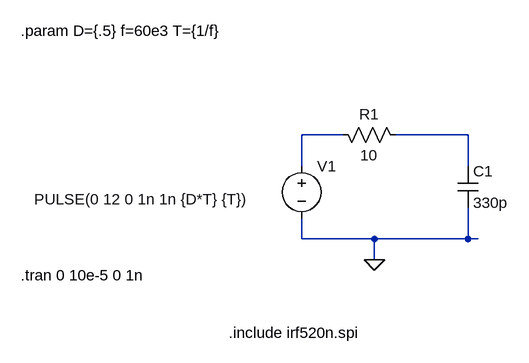
[diagram p0: schematic Draft1.asc]
Draft1.asc, the LTspice schematic file:
Version 4
SHEET 1 880 680
WIRE 144 112 80 112
WIRE 336 112 224 112
WIRE 80 160 80 112
WIRE 336 160 336 112
WIRE 80 272 80 240
WIRE 192 272 80 272
WIRE 336 272 336 224
WIRE 336 272 192 272
WIRE 352 272 336 272
WIRE 192 304 192 272
FLAG 192 304 0
SYMBOL res 128 96 M90
WINDOW 0 0 56 VBottom 2
WINDOW 3 32 56 VTop 2
SYMATTR InstName R1
SYMATTR Value 10
SYMBOL voltage 80 144 R0
WINDOW 3 -411 67 Left 2
WINDOW 123 0 0 Left 0
WINDOW 39 0 0 Left 0
SYMATTR InstName V1
SYMATTR Value PULSE(0 12 0 1n 1n {D*T} {T})
SYMBOL cap 320 160 R0
SYMATTR InstName C1
SYMATTR Value 330p
TEXT -352 -48 Left 2 !.param D={.5} f=60e3 T={1/f}
TEXT -352 328 Left 2 !.tran 0 10e-5 0 1n
TEXT -32 416 Left 2 !.include irf520n.spi

The netlist it stands for:
* Draft1.asc
R1 N001 N002 10
V1 N001 0 PULSE(0 12 0 1n 1n {D*T} {T})
C1 N002 0 330p
.param D={.5} f=60e3 T={1/f}
.tran 0 10e-5 0 1n
.include irf520n.spi
.backanno
.end